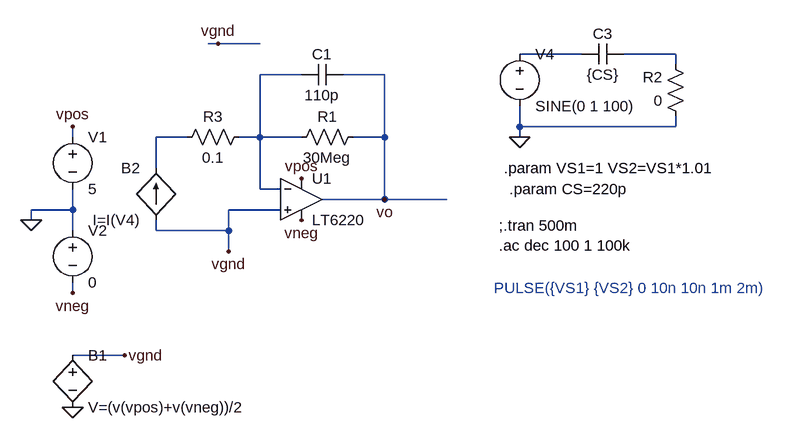
[diagram p0: schematic esf_op-amp.asc]
esf_op-amp.asc, the LTspice schematic file:
Version 4
SHEET 1 996 680
WIRE 80 -48 64 -48
WIRE 144 -48 80 -48
WIRE 640 -32 544 -32
WIRE 784 -32 704 -32
WIRE 784 -16 784 -32
WIRE 208 0 144 0
WIRE 336 0 272 0
WIRE 544 80 544 48
WIRE 784 80 784 64
WIRE 784 80 544 80
WIRE -144 96 -144 80
WIRE 32 96 -16 96
WIRE 144 96 144 0
WIRE 144 96 112 96
WIRE 208 96 144 96
WIRE 336 96 336 0
WIRE 336 96 288 96
WIRE 544 96 544 80
WIRE -16 144 -16 96
WIRE 144 176 144 96
WIRE 176 176 144 176
WIRE 336 192 336 96
WIRE 336 192 240 192
WIRE 432 192 336 192
WIRE -144 208 -144 176
WIRE -144 208 -208 208
WIRE 176 208 96 208
WIRE -208 224 -208 208
WIRE -144 240 -144 208
WIRE -16 240 -16 224
WIRE 96 240 96 208
WIRE 96 240 -16 240
WIRE 96 272 96 240
WIRE -144 336 -144 320
WIRE -64 432 -144 432
FLAG -208 224 0
FLAG -144 80 vpos
FLAG -144 336 vneg
FLAG 208 224 vneg
FLAG 208 160 vpos
FLAG -144 512 0
FLAG -64 432 vgnd
FLAG 96 272 vgnd
FLAG 80 -48 vgnd
FLAG 336 192 vo
FLAG 544 96 0
DATAFLAG 400 192 "$"
SYMBOL voltage -144 80 R0
SYMATTR InstName V1
SYMATTR Value 5
SYMBOL voltage -144 224 R0
SYMATTR InstName V2
SYMATTR Value 0
SYMBOL Res 800 80 R180
WINDOW 0 36 76 Left 2
WINDOW 3 36 40 Left 2
SYMATTR InstName R2
SYMATTR Value 0
SYMBOL Cap 704 -48 R90
WINDOW 0 0 32 VBottom 2
WINDOW 3 32 32 VTop 2
SYMATTR InstName C3
SYMATTR Value {CS}
SYMBOL voltage 544 -48 R0
SYMATTR InstName V4
SYMATTR Value SINE(0 1 100)
SYMATTR Value2 AC 1
SYMBOL bv -144 416 R0
SYMATTR InstName B1
SYMATTR Value V=(v(vpos)+v(vneg))/2
SYMBOL OpAmps/LT6220 208 192 R0
SYMATTR InstName U1
SYMBOL bi -16 224 R180
WINDOW 0 24 80 Left 2
WINDOW 3 24 0 Left 2
SYMATTR InstName B2
SYMATTR Value I=I(V4)
SYMBOL Res 128 80 R90
WINDOW 0 0 56 VBottom 2
WINDOW 3 32 56 VTop 2
SYMATTR InstName R3
SYMATTR Value 0.1
SYMBOL Cap 272 -16 R90
WINDOW 0 0 32 VBottom 2
WINDOW 3 32 32 VTop 2
SYMATTR InstName C1
SYMATTR Value 110p
SYMBOL Res 304 80 R90
WINDOW 0 0 56 VBottom 2
WINDOW 3 32 56 VTop 2
SYMATTR InstName R1
SYMATTR Value 30Meg
TEXT 512 232 Left 2 !;.tran 500m\n.ac dec 100 1 100k
TEXT 520 144 Left 2 !.param VS1=1 VS2=VS1*1.01
TEXT 504 328 Left 2 ;PULSE({VS1} {VS2} 0 10n 10n 1m 2m)
TEXT 528 176 Left 2 !.param CS=220p

The netlist it stands for:
* esf_op-amp.asc
V1 vpos 0 5
V2 0 vneg 0
R2 0 N002 0
C3 N002 N001 {CS}
V4 N001 0 SINE(0 1 100) AC 1
B1 vgnd 0 V=(v(vpos)+v(vneg))/2
XU1 vgnd N003 vpos vneg vo LT6220  ; pins In+ In- V+ V- OUT
B2 vgnd N004 I=I(V4)
R3 N003 N004 0.1
C1 vo N003 110p
R1 vo N003 30Meg
;.tran 500m
.ac dec 100 1 100k
.param VS1=1 VS2=VS1*1.01
* PULSE({VS1} {VS2} 0 10n 10n 1m 2m)
.param CS=220p
.lib LTC4.lib
.backanno
.end